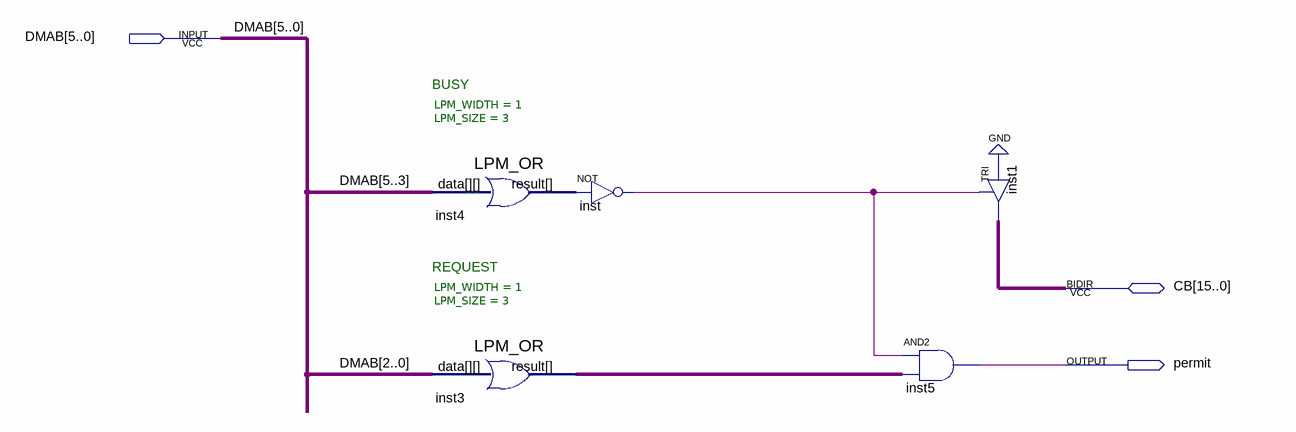
[diagram p0: schematic sheet]
// Quartus schematic DMA.bdf as structural Verilog: 5 symbols, 3 pins
module DMA (
  input  [5:0] DMAB,
  inout  [15:0] CB,
  output permit
);

  wire inst3_result, inst4_result, inst_out;

  LPM_OR #(.LPM_WIDTH(1), .LPM_SIZE(3)) inst4 (.data(DMAB[5:3]), .result(inst4_result));
  LPM_OR #(.LPM_WIDTH(1), .LPM_SIZE(3)) inst3 (.data(DMAB[2:0]), .result(inst3_result));
  not inst (inst_out, inst4_result);
  and inst5 (permit, inst_out, inst3_result);
  TRI inst1[15:0] (.IN(1'b0), .OE(inst_out), .OUT(CB));

  // Notes on the sheet:
  //   BUSY
  //   REQUEST
endmodule
